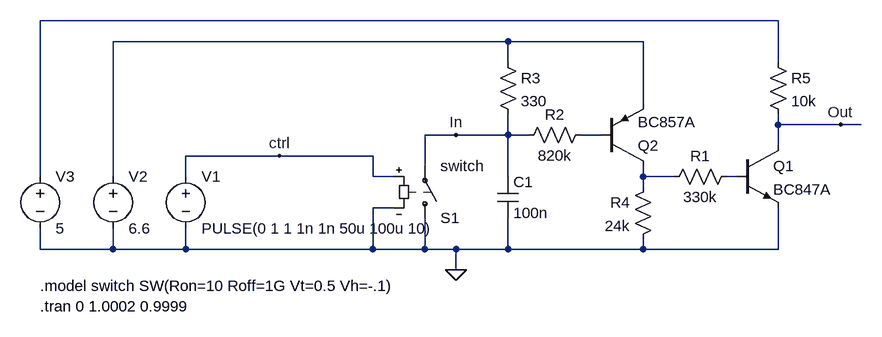
[diagram p0: schematic xlr_pegelwandler_v_1_2.asc]
xlr_pegelwandler_v_1_2.asc, the LTspice schematic file:
Version 4
SHEET 1 880 680
WIRE 256 -64 -880 -64
WIRE -160 -32 -768 -32
WIRE 48 -32 -160 -32
WIRE -160 0 -160 -32
WIRE 256 0 256 -64
WIRE 48 64 48 -32
WIRE 256 96 256 80
WIRE 352 96 256 96
WIRE 384 96 352 96
WIRE -240 112 -288 112
WIRE -160 112 -160 80
WIRE -160 112 -240 112
WIRE -128 112 -160 112
WIRE -16 112 -48 112
WIRE 256 128 256 96
WIRE -512 144 -656 144
WIRE -368 144 -512 144
WIRE -288 160 -288 112
WIRE -880 176 -880 -64
WIRE -768 176 -768 -32
WIRE -656 176 -656 144
WIRE -368 176 -368 144
WIRE -336 176 -368 176
WIRE -160 176 -160 112
WIRE 48 176 48 160
WIRE 96 176 48 176
WIRE 192 176 176 176
WIRE 48 192 48 176
WIRE -336 224 -368 224
WIRE -880 288 -880 256
WIRE -768 288 -768 256
WIRE -768 288 -880 288
WIRE -656 288 -656 256
WIRE -656 288 -768 288
WIRE -368 288 -368 224
WIRE -368 288 -656 288
WIRE -288 288 -288 240
WIRE -288 288 -368 288
WIRE -240 288 -288 288
WIRE -160 288 -160 240
WIRE -160 288 -240 288
WIRE 48 288 48 272
WIRE 48 288 -160 288
WIRE 256 288 256 224
WIRE 256 288 48 288
WIRE -240 320 -240 288
FLAG -240 320 0
FLAG 352 96 Out
FLAG -512 144 ctrl
FLAG -240 112 In
SYMBOL npn 192 128 R0
SYMATTR InstName Q1
SYMATTR Value BC847A
SYMBOL pnp -16 160 M180
SYMATTR InstName Q2
SYMATTR Value BC857A
SYMBOL res 80 192 R270
WINDOW 0 32 56 VTop 2
WINDOW 3 0 56 VBottom 2
SYMATTR InstName R1
SYMATTR Value 330k
SYMBOL res -144 128 R270
WINDOW 0 32 56 VTop 2
WINDOW 3 0 56 VBottom 2
SYMATTR InstName R2
SYMATTR Value 820k
SYMBOL res -176 -16 R0
SYMATTR InstName R3
SYMATTR Value 330
SYMBOL res 64 176 M0
SYMATTR InstName R4
SYMATTR Value 24k
SYMBOL res 240 -16 R0
SYMATTR InstName R5
SYMATTR Value 10k
SYMBOL cap -176 176 R0
SYMATTR InstName C1
SYMATTR Value 100n
SYMBOL voltage -656 160 R0
WINDOW 123 0 0 Left 2
WINDOW 39 0 0 Left 2
SYMATTR InstName V1
SYMATTR Value PULSE(0 1 1 1n 1n 50u 100u 10)
SYMBOL voltage -768 160 R0
WINDOW 123 0 0 Left 2
WINDOW 39 0 0 Left 2
SYMATTR InstName V2
SYMATTR Value 6.6
SYMBOL voltage -880 160 R0
WINDOW 123 0 0 Left 2
WINDOW 39 0 0 Left 2
SYMATTR InstName V3
SYMATTR Value 5
SYMBOL sw -288 256 M180
SYMATTR InstName S1
SYMATTR Value switch
TEXT -880 344 Left 2 !.model switch SW(Ron=10 Roff=1G Vt=0.5 Vh=-.1)
TEXT -880 376 Left 2 !.tran 0 1.0002 0.9999

The netlist it stands for:
* xlr_pegelwandler_v_1_2.asc
Q1 Out N005 0 0 BC847A
Q2 N004 N003 N002 0 BC857A
R1 N004 N005 330k
R2 In N003 820k
R3 N002 In 330
R4 N004 0 24k
R5 N001 Out 10k
C1 In 0 100n
V1 ctrl 0 PULSE(0 1 1 1n 1n 50u 100u 10)
V2 N002 0 6.6
V3 N001 0 5
S1 0 In ctrl 0 switch
.model NPN NPN
.model PNP PNP
.lib standard.bjt
.model switch SW(Ron=10 Roff=1G Vt=0.5 Vh=-.1)
.tran 0 1.0002 0.9999
.backanno
.end